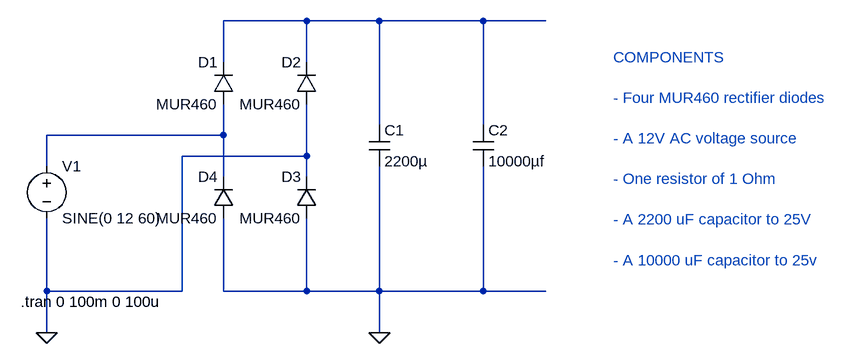
[diagram p0: schematic monofasico (abierto).asc]
monofasico (abierto).asc, the LTspice schematic file:
Version 4.1
SHEET 1 1328 680
WIRE 496 -64 368 -64
WIRE 608 -64 496 -64
WIRE 768 -64 608 -64
WIRE 864 -64 768 -64
WIRE 368 0 368 -64
WIRE 496 0 496 -64
WIRE 608 96 608 -64
WIRE 768 96 768 -64
WIRE 368 112 368 64
WIRE 368 112 96 112
WIRE 496 144 496 64
WIRE 496 144 304 144
WIRE 96 160 96 112
WIRE 368 176 368 112
WIRE 496 176 496 144
WIRE 96 352 96 240
WIRE 304 352 304 144
WIRE 304 352 96 352
WIRE 368 352 368 240
WIRE 496 352 496 240
WIRE 496 352 368 352
WIRE 608 352 608 160
WIRE 608 352 496 352
WIRE 768 352 768 160
WIRE 768 352 608 352
WIRE 864 352 768 352
WIRE 96 416 96 352
WIRE 608 416 608 352
FLAG 608 416 0
FLAG 96 416 0
SYMBOL voltage 96 144 R0
WINDOW 123 0 0 Left 0
WINDOW 39 0 0 Left 0
SYMATTR InstName V1
SYMATTR Value SINE(0 12 60)
SYMBOL diode 384 64 R180
WINDOW 0 24 64 Left 2
WINDOW 3 24 0 Left 2
SYMATTR InstName D1
SYMATTR Value MUR460
SYMBOL diode 512 64 R180
WINDOW 0 24 64 Left 2
WINDOW 3 24 0 Left 2
SYMATTR InstName D2
SYMATTR Value MUR460
SYMBOL diode 512 240 R180
WINDOW 0 24 64 Left 2
WINDOW 3 24 0 Left 2
SYMATTR InstName D3
SYMATTR Value MUR460
SYMBOL diode 384 240 R180
WINDOW 0 24 64 Left 2
WINDOW 3 24 0 Left 2
SYMATTR InstName D4
SYMATTR Value MUR460
SYMBOL cap 592 96 R0
SYMATTR InstName C1
SYMATTR Value 2200µ
SYMATTR SpiceLine V=50
SYMBOL cap 752 96 R0
SYMATTR InstName C2
SYMATTR Value 10000µf
SYMATTR SpiceLine V=25
TEXT 56 368 Left 2 !.tran 0 100m 0 100u
TEXT 968 -8 Left 2 ;COMPONENTS\n \n- Four MUR460 rectifier diodes\n \n- A 12V AC voltage source\n \n- One resistor of 1 Ohm\n \n- A 2200 uF capacitor to 25V\n \n- A 10000 uF capacitor to 25v

The netlist it stands for:
* monofasico (abierto).asc
V1 N002 0 SINE(0 12 60)
D1 N002 N001 MUR460
D2 0 N001 MUR460
D3 0 0 MUR460
D4 0 N002 MUR460
C1 N001 0 2200µ V=50
C2 N001 0 10000µf V=25
.model D D
.lib standard.dio
.tran 0 100m 0 100u
* COMPONENTS
* - Four MUR460 rectifier diodes
* - A 12V AC voltage source
* - One resistor of 1 Ohm
* - A 2200 uF capacitor to 25V
* - A 10000 uF capacitor to 25v
.backanno
.end